# EAGLE design temp (EAGLE 6.2)
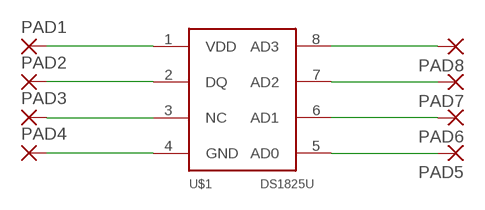
[diagram p0: schematic, sheet 1]

## Parts
PAD1  2,15/1,0  [2,15/1,0]
PAD2  2,15/1,0  [2,15/1,0]
PAD3  2,15/1,0  [2,15/1,0]
PAD4  2,15/1,0  [2,15/1,0]
PAD5  2,15/1,0  [2,15/1,0]
PAD6  2,15/1,0  [2,15/1,0]
PAD7  2,15/1,0  [2,15/1,0]
PAD8  2,15/1,0  [2,15/1,0]
U$1  DS1825U  [UMAX8]

## Nets
N$1: PAD1.1(P) U$1.1(VDD)
N$2: PAD2.1(P) U$1.2(DQ)
N$3: PAD3.1(P) U$1.3(NC)
N$4: PAD4.1(P) U$1.4(GND)
N$5: PAD8.1(P) U$1.8(AD3)
N$6: PAD7.1(P) U$1.7(AD2)
N$7: PAD6.1(P) U$1.6(AD1)
N$8: PAD5.1(P) U$1.5(AD0)

## Library data of the parts
PAD1-PAD8 = wirepad:2,15/1,0: THROUGH-HOLE PAD
U$1 = temp_sensors:DS1825U

## Board
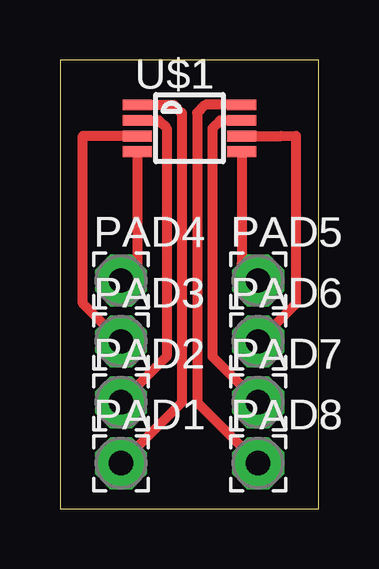
[diagram p1: board, top side]

Size 10.78 x 18.72 mm. Coordinates in mm from the lower left corner, seen from the top.
Outline: 0,0 10.78,0 10.78,18.72 0,18.72 0,0
Copper layers (1*16): Top 0.035mm / dielectric 1.5mm / Bottom 0.035mm
Design rules: minimum track width 10mil, minimum drill 24mil, track to track 8mil, track to pad 8mil, pad to pad 8mil, via to via 8mil, smd to smd 8mil, copper to edge 40mil, drill to drill 8mil, minimum pad ring 10mil, minimum via ring 8mil, stop-mask expansion 4mil, vias tented up to drill 0mil, thermal gap 10mil

### Footprints (pad centres in the part's own frame; a part is rotated, then mirrored left to right if it is on the bottom)
2,15/1,0 = drill 1.016 pad 2.159 octagon: 1 0,0
UMAX8 = smd 0.45 x 1.2: 1 -0.975,-2.175; 2 -0.325,-2.175; 3 0.325,-2.175; 4 0.975,-2.175; 5 0.975,2.175; 6 0.325,2.175; 7 -0.325,2.175; 8 -0.975,2.175

### Placement (x,y rotation side)
PAD1  2.54,1.91 0 top
PAD2  2.54,4.45 0 top
PAD3  2.54,6.99 0 top
PAD4  2.54,9.53 0 top
PAD5  8.26,9.53 0 top
PAD6  8.26,6.99 0 top
PAD7  8.26,4.45 0 top
PAD8  8.26,1.91 0 top
U$1  5.4,15.88 270 top

### Tracks (layer width: path | path; a pad name or v marks a point on that pad's centre or on a via)
N$1
  Top 0.406: U$1.1 4.74,16.85 5.08,16.51 5.08,4.45 PAD1.1
N$2
  Top 0.406: U$1.2 4.12,16.2 4.45,15.88 4.45,6.35 PAD2.1
N$3
  Top 0.406: PAD3.1 0.95,8.57 0.95,15.56 U$1.3
N$4
  Top 0.406: U$1.4 3.22,10.21 PAD4.1
N$5
  Top 0.406: U$1.8 6.05,16.85 5.71,16.51 5.71,4.45 PAD8.1
N$6
  Top 0.406: U$1.7 6.67,16.2 6.35,15.88 6.35,6.35 PAD7.1
N$7
  Top 0.406: PAD6.1 9.84,8.57 9.84,15.56 9.21,15.55 U$1.6
N$8
  Top 0.406: U$1.5 7.57,10.21 PAD5.1

### Text on the board
_tNames: U$1 | PAD4 | PAD5 | PAD3 | PAD6 | PAD2 | PAD7 | PAD1 | PAD8